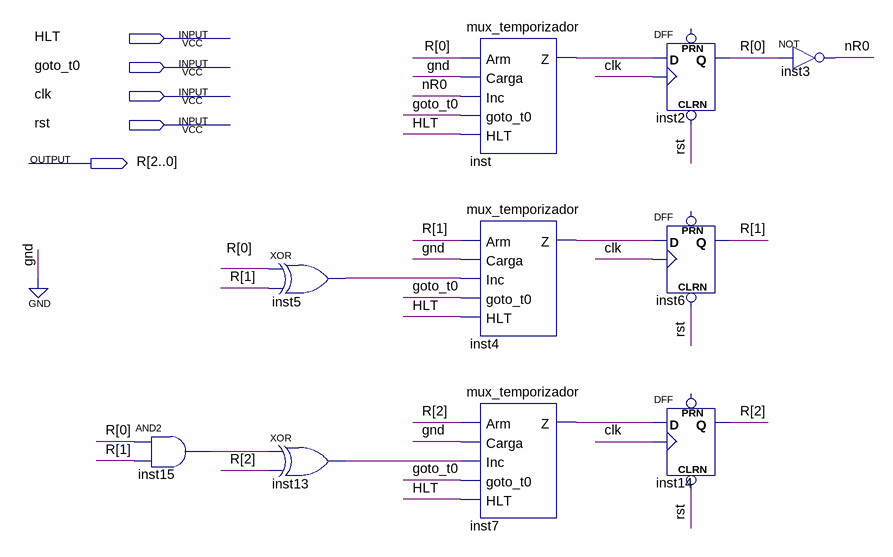
[diagram p0: schematic sheet]
// Quartus schematic contador3b.bdf as structural Verilog: 10 symbols, 5 pins
module contador3b (
  input  HLT,
  input  goto_t0,
  input  clk,
  input  rst,
  output [2:0] R
);

  wire inst4_z, inst5_out, inst7_z, inst13_out, inst15_out, inst_z, nR0;

  and inst15 (inst15_out, R[0], R[1]);
  xor inst5 (inst5_out, R[0], R[1]);
  xor inst13 (inst13_out, inst15_out, R[2]);
  mux_temporizador inst (.Arm(R[0]), .Carga(1'b0), .Inc(nR0), .goto_t0(goto_t0), .HLT(HLT), .Z(inst_z));
  mux_temporizador inst4 (.Arm(R[1]), .Carga(1'b0), .Inc(inst5_out), .goto_t0(goto_t0), .HLT(HLT), .Z(inst4_z));
  mux_temporizador inst7 (.Arm(R[2]), .Carga(1'b0), .Inc(inst13_out), .goto_t0(goto_t0), .HLT(HLT), .Z(inst7_z));
  DFF inst2 (.CLRN(rst), .CLK(clk), .D(inst_z), .Q(R[0]));  // open: PRN
  DFF inst6 (.CLRN(rst), .CLK(clk), .D(inst4_z), .Q(R[1]));  // open: PRN
  DFF inst14 (.CLRN(rst), .CLK(clk), .D(inst7_z), .Q(R[2]));  // open: PRN
  not inst3 (nR0, R[0]);
endmodule
